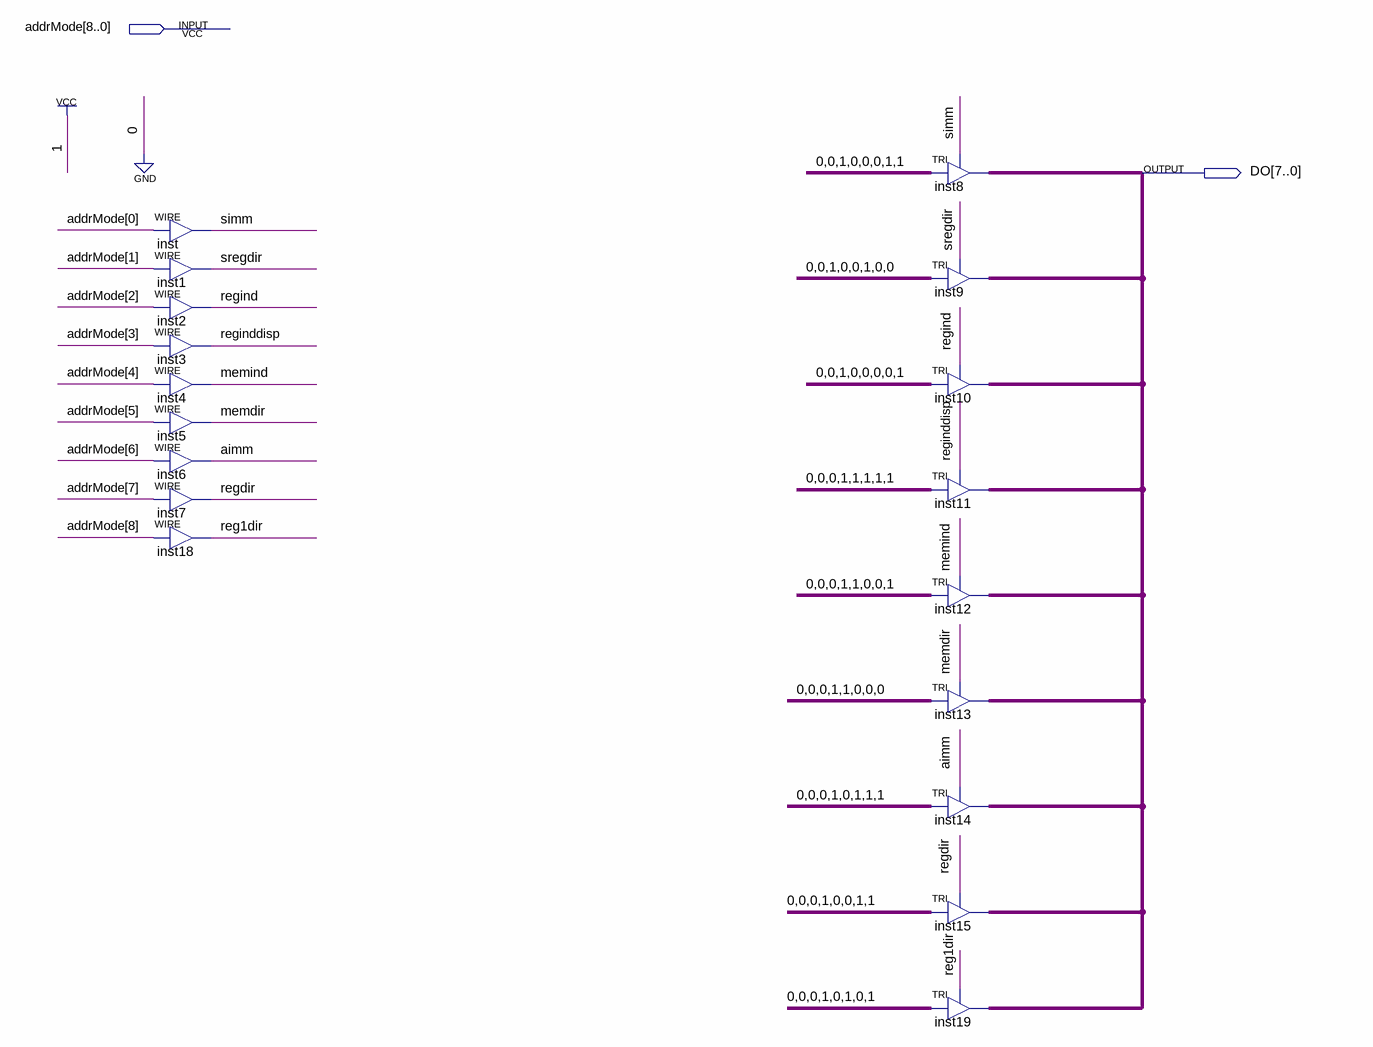
[diagram p0: schematic sheet]
// Quartus schematic KMADR.bdf as structural Verilog: 18 symbols, 2 pins
module KMADR (
  input  [8:0] addrMode,
  output [7:0] DO
);

  wire aimm, memdir, memind, reg1dir, regdir, regind, reginddisp, simm, sregdir;

  assign simm = addrMode[0];  // WIRE inst
  assign sregdir = addrMode[1];  // WIRE inst1
  assign regind = addrMode[2];  // WIRE inst2
  assign reginddisp = addrMode[3];  // WIRE inst3
  assign memind = addrMode[4];  // WIRE inst4
  assign memdir = addrMode[5];  // WIRE inst5
  assign aimm = addrMode[6];  // WIRE inst6
  assign regdir = addrMode[7];  // WIRE inst7
  assign reg1dir = addrMode[8];  // WIRE inst18
  TRI inst8[7:0] (.IN(8'b00100011), .OE(simm), .OUT(DO));
  TRI inst9[7:0] (.IN(8'b00100100), .OE(sregdir), .OUT(DO));
  TRI inst10[7:0] (.IN(8'b00100001), .OE(regind), .OUT(DO));
  TRI inst11[7:0] (.IN(8'b00011111), .OE(reginddisp), .OUT(DO));
  TRI inst12[7:0] (.IN(8'b00011001), .OE(memind), .OUT(DO));
  TRI inst13[7:0] (.IN(8'b00011000), .OE(memdir), .OUT(DO));
  TRI inst14[7:0] (.IN(8'b00010111), .OE(aimm), .OUT(DO));
  TRI inst15[7:0] (.IN(8'b00010011), .OE(regdir), .OUT(DO));
  TRI inst19[7:0] (.IN(8'b00010101), .OE(reg1dir), .OUT(DO));
endmodule
